# EAGLE design Breadboard (EAGLE 7.5.0)
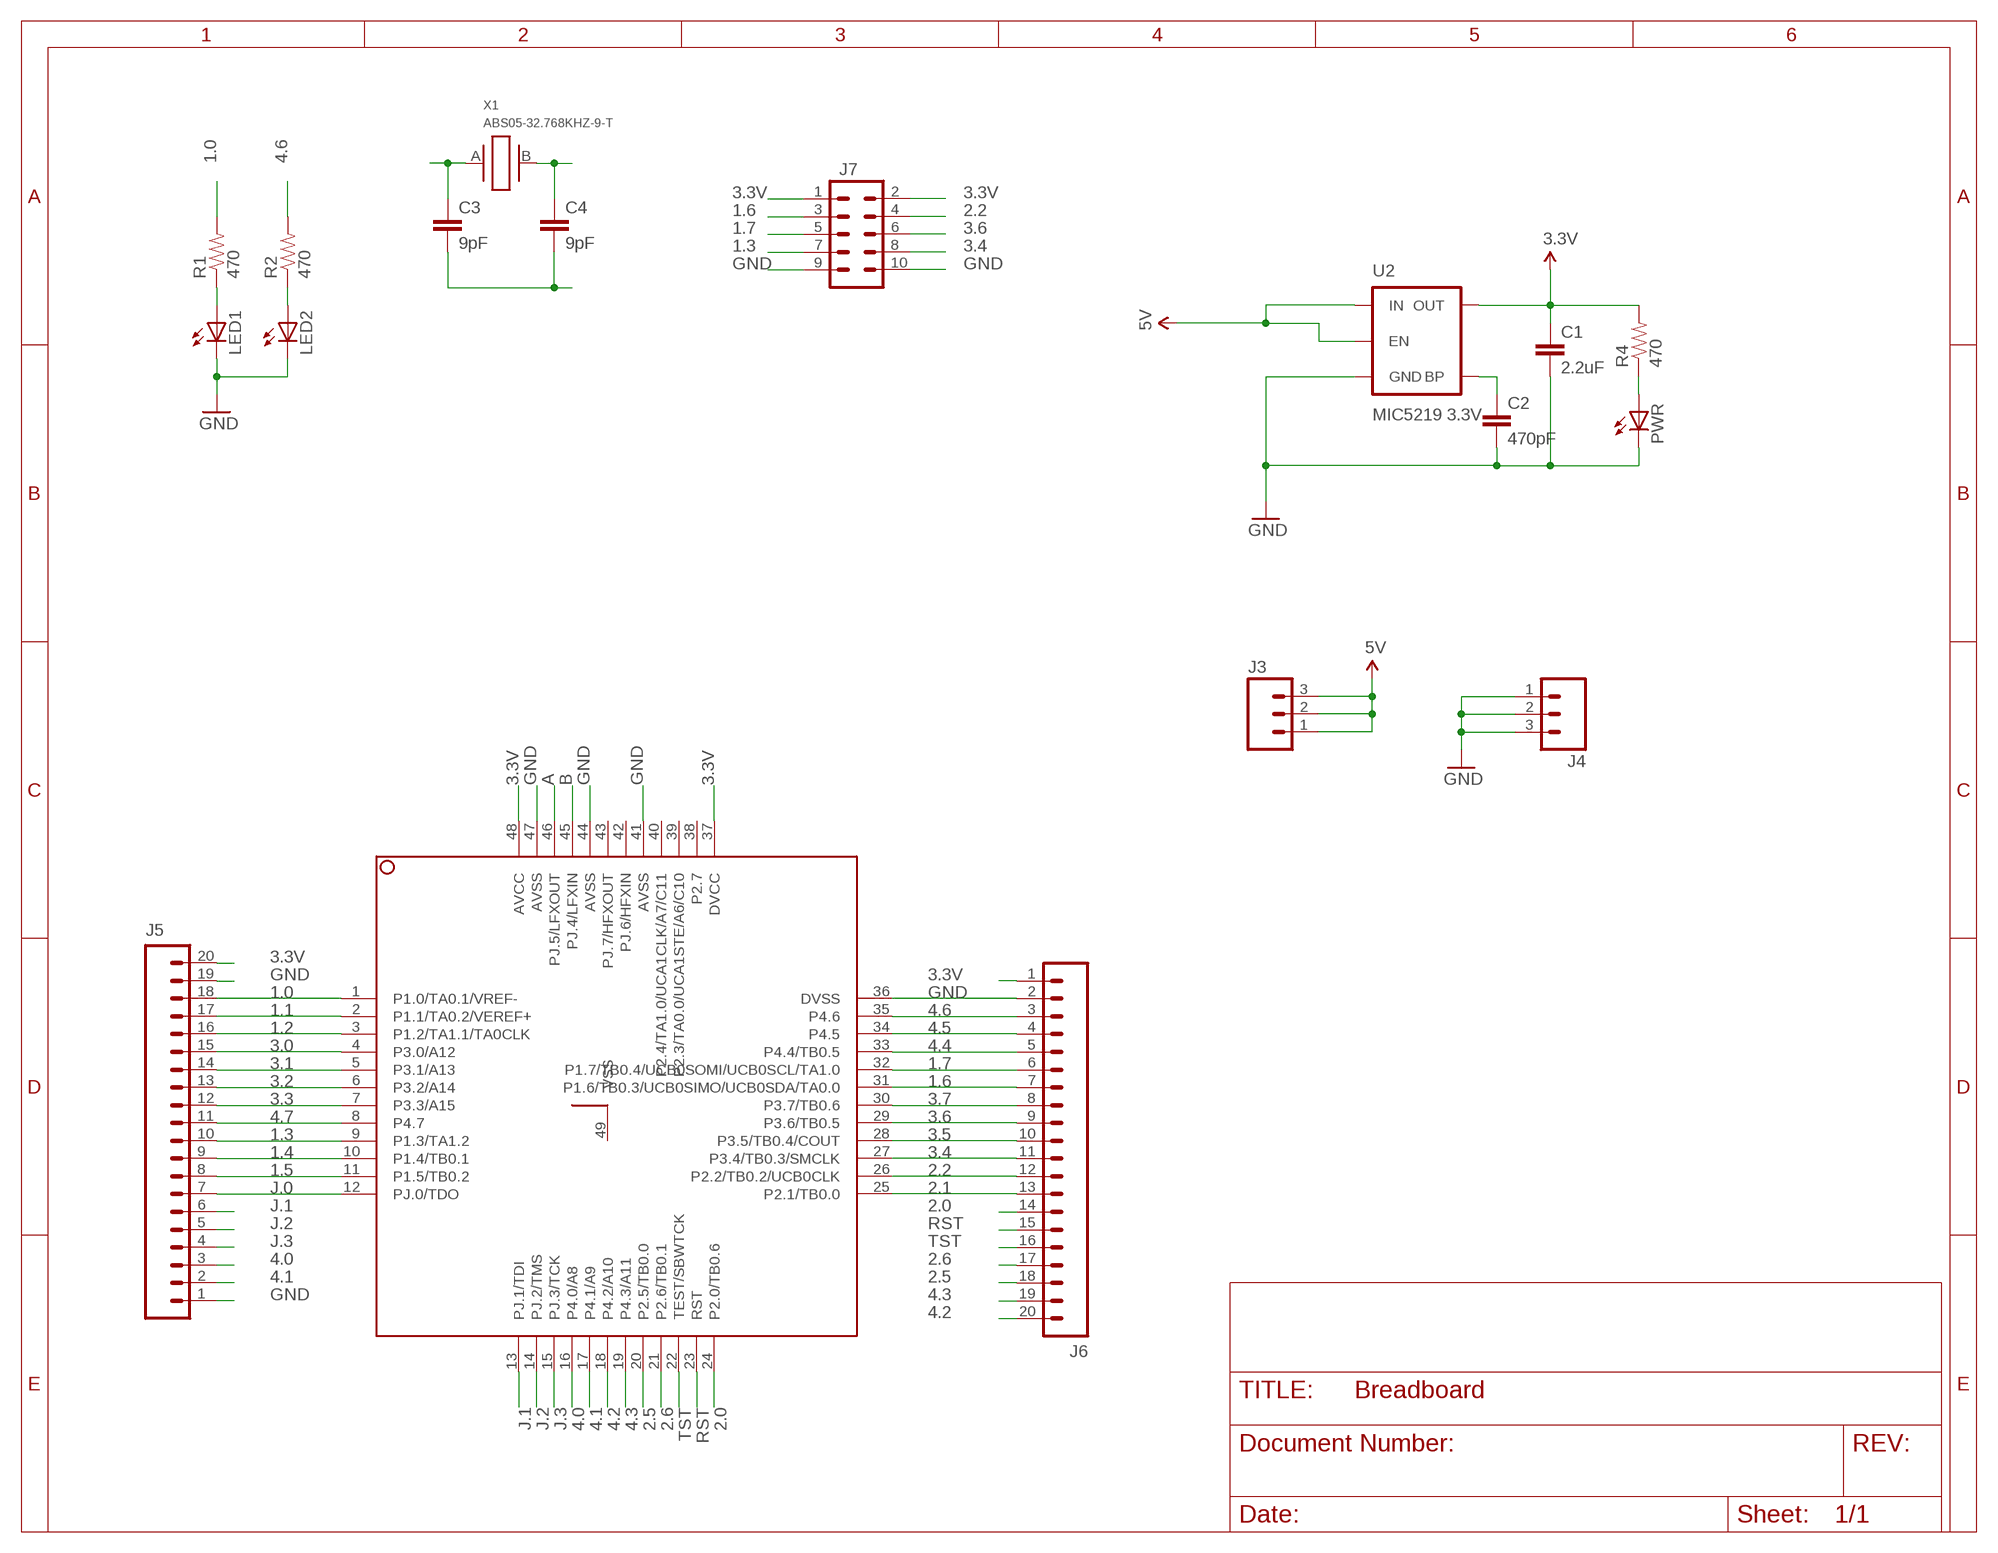
[diagram p0: schematic, sheet 1]

## Parts
C1  2.2uF  2.2UF-10V-20%(0603)  [0603-CAP]
C2  470pF  470PF-50V-5%(0603)SMD  [0603-CAP]
C3  9pF  9.0PF-50V-10%(0603)  [0603-CAP]
C4  9pF  9.0PF-50V-10%(0603)  [0603-CAP]
J3  M031X03_NO_SILK  [1X03_NO_SILK]
J4  M031X03_NO_SILK  [1X03_NO_SILK]
J5  M20NOSILK  [1X20_NOSILK]
J6  M20NOSILK  [1X20_NOSILK]
J7  M05X2NO_SILK  [2X5_NOSILK]
LED1  LEDCHIPLED_0805  [CHIPLED_0805]
LED2  LEDCHIPLED_0805  [CHIPLED_0805]
PWR  LEDCHIPLED_0805  [CHIPLED_0805]
R1  470  RESISTOR0805-RES  [0805]
R2  470  RESISTOR0805-RES  [0805]
R4  470  RESISTOR0805-RES  [0805]
U1  MSP430FR5969_RGZ_48  [RGZ48_4P1X4P1]
U2  MIC5219 3.3V  V_REG_MIC52193.3V  [SOT23-5]
X1  ABS05-32.768KHZ-9-T  [ABS05]

## Nets
1.0: J5.18 R1.2 U1.1(P1.0/TA0.1/VREF-)
1.1: J5.17 U1.2(P1.1/TA0.2/VEREF+)
1.2: J5.16 U1.3(P1.2/TA1.1/TA0CLK)
1.3: J5.10 J7.7 U1.9(P1.3/TA1.2)
1.4: J5.9 U1.10(P1.4/TB0.1)
1.5: J5.8 U1.11(P1.5/TB0.2)
1.6: J6.7 J7.3 U1.31(P1.6/TB0.3/UCB0SIMO/UCB0SDA/TA0.0)
1.7: J6.6 J7.5 U1.32(P1.7/TB0.4/UCB0SOMI/UCB0SCL/TA1.0)
2.0: J6.14 U1.24(P2.0/TB0.6)
2.1: J6.13 U1.25(P2.1/TB0.0)
2.2: J6.12 J7.4 U1.26(P2.2/TB0.2/UCB0CLK)
2.5: J6.18 U1.20(P2.5/TB0.0)
2.6: J6.17 U1.21(P2.6/TB0.1)
3.0: J5.15 U1.4(P3.0/A12)
3.1: J5.14 U1.5(P3.1/A13)
3.2: J5.13 U1.6(P3.2/A14)
3.3: J5.12 U1.7(P3.3/A15)
3.3V: C1.1 J5.20 J6.1 J7.1 J7.2 R4.2 U1.37(DVCC) U1.48(AVCC) U2.5(OUT)
3.4: J6.11 J7.8 U1.27(P3.4/TB0.3/SMCLK)
3.5: J6.10 U1.28(P3.5/TB0.4/COUT)
3.6: J6.9 J7.6 U1.29(P3.6/TB0.5)
3.7: J6.8 U1.30(P3.7/TB0.6)
4.0: J5.3 U1.16(P4.0/A8)
4.1: J5.2 U1.17(P4.1/A9)
4.2: J6.20 U1.18(P4.2/A10)
4.3: J6.19 U1.19(P4.3/A11)
4.4: J6.5 U1.33(P4.4/TB0.5)
4.5: J6.4 U1.34(P4.5)
4.6: J6.3 R2.2 U1.35(P4.6)
4.7: J5.11 U1.8(P4.7)
5V: J3.1 J3.2 J3.3 U2.1(IN) U2.3(EN)
A: C3.1 U1.46(PJ.5/LFXOUT) X1.A
B: C4.1 U1.45(PJ.4/LFXIN) X1.B
GND: C1.2 C2.2 C3.2 C4.2 J4.1 J4.2 J4.3 J5.1 J5.19 J6.2 J7.9 J7.10 LED1.C LED2.C PWR.C U1.36(DVSS) U1.41(AVSS) U1.44(AVSS) U1.47(AVSS) U2.2(GND)
J.0: J5.7 U1.12(PJ.0/TDO)
J.1: J5.6 U1.13(PJ.1/TDI)
J.2: J5.5 U1.14(PJ.2/TMS)
J.3: J5.4 U1.15(PJ.3/TCK)
N$1: LED2.A R2.1
N$2: PWR.A R4.1
N$4: LED1.A R1.1
N$7: C2.1 U2.4(BP)
RST: J6.15 U1.23(RST)
TST: J6.16 U1.22(TEST/SBWTCK)
Unconnected: U1.38(P2.7) U1.39(P2.3/TA0.0/UCA1STE/A6/C10) U1.40(P2.4/TA1.0/UCA1CLK/A7/C11) U1.42(PJ.6/HFXIN) U1.43(PJ.7/HFXOUT) U1.49(VSS)

## Library data of the parts
C1 = SparkFun-Capacitors:2.2UF-10V-20%(0603): CAP-07888; PROD_ID: CAP-07888
C2 = SparkFun-Capacitors:470PF-50V-5%(0603): CAP-07884; PROD_ID: CAP-07884
C3 C4 = SparkFun-Capacitors:9.0PF-50V-10%(0603): CAP-09341; PROD_ID: CAP-09341; VALUE: 9.0pF
J3 J4 = SparkFun-Connectors:M03: Header 3 Standard 3-pin 0.1" header. Use with straight break away headers (SKU : PRT-00116), right angle break away headers (PRT-00553), swiss pins (PRT-00743), machine pins (PRT-00117), and female headers (PRT-00115). Molex polarized connector foot print use with SKU : PRT-08232 with associated crimp pins and housings.
J5 J6 = SparkFun-Connectors:M20: 1x20 .1" header This is just like the LOCK variant in that the holes are staggared by 5 mil, but except for the last two holes. They are not altered from the "standard" footprint layout. This is used for a special purpose on the layout of our Graphic LCD Backpack. Make sure you want to use this device before selecting it for you project!
J7 = SparkFun-Connectors:M05X2: Header 5x2 Standard 10-pin dual row 0.1" header. Commonly used with AVR-ISP. Use with Spark Fun Electronics SKU: PRT-00778
LED1 LED2 PWR = adafruit:LED: LED OSRAM: - CHIPLED LG R971, LG N971, LY N971, LG Q971, LY Q971, LO R971, LY R971 LH N974, LH R974 LS Q976, LO Q976, LY Q976 LO Q996 - Hyper CHIPLED LW Q18S LB Q993, LB Q99A, LB R99A - SideLED LS A670, LO A670, LY A670, LG A670, LP A670 LB A673, LV A673, LT A673, LW A673 LH A674 LY A675 LS A676, LA A676, LO A676, LY A676, LW A676 LS A679, LY A679, LG A679 - Hyper Micro SIDELED® LS Y876, LA Y876, LO Y876, LY Y876 LT Y87S - SmartLED LW L88C, LW L88S LB L89C, LB L89S, LG L890 LS L89K, LO L89K, LY L89K LS L896, LA L896, LO L896, LY L896 - TOPLED LS T670, LO T670, LY T670, LG T670, LP T670 LSG T670, LSP T670, LSY T670, LOP T670, LYG T670 LG T671, LOG T671, LSG T671 LB T673, LV T673, LT T673, LW T673 LH T674 LS T676, LA T676, LO T676, LY T676, LB T676, LH T676, LSB T676, LW T676 LB T67C, LV T67C, LT T67C, LS T67K, LO T67K, LY T67K, LW E67C LS E67B, LA E67B, LO E67B, LY E67B, LB E67C, LV E67C, LT E67C LW T67C LS T679, LY T679, LG T679 LS T770, LO T770, LY T770, LG T770, LP T770 LB T773, LV T773, LT T773, LW T773 LH T774 LS E675, LA E675, LY E675, LS T675 LS T776, LA T776, LO T776, LY T776, LB T776 LHGB T686 LT T68C, LB T68C - Hyper Mini TOPLED® LB M676 - Mini TOPLED Santana® LG M470 LS M47K, LO M47K, LY M47K Source: http://www.osram.convergy.de/
R1 R2 R4 = SparkFun-Passives:RESISTOR: Resistor Basic schematic elements and footprints for 0603, 1206, and PTH resistors.
U1 = msp430:MSP430FR5969_RGZ_48: MSP430FR59xx Mixed Signal Microcontroller Package: RGZ-S-PQVFN-N48 (MSP430FR596x and MSP430FR586x) Description The Texas Instruments MSP430FR58xx and MSP430FR59xx family of ultralow-power microcontrollers consists of several devices featuring embedded FRAM nonvolatile memory, an ultralow-power 16-bit MSP430 CPU, and different sets of peripherals targeted for various applications. The architecture, FRAM, and peripherals, combined with seven low-power modes, are optimized to achieve extended battery life in portable and wireless sensing applications. FRAM is a new nonvolatile memory that combines the speed, flexibility, and endurance of SRAM with the stability and reliability of flash, all at lower total power consumption.; MANUFACTURER_PART_NUMBER: msp430fr5969_rgz_48; VENDOR: Texas Instruments
U2 = SparkFun-PowerIC:V_REG_MIC5219: V_REG MIC5219 Standard 3.3V and 5V 500mA LDO voltage regulator in SOT-23 layout. Micrel part MIC5219. BP (by-pass) pin is used to lower output noise with 470pF cap, may be left open.; PROD_ID: VREG-09872
X1 = abs05:ABS05-32.768KHZ: 32.768kHz Crystal; DIGIKEY: 535-11897-1-ND

## Board
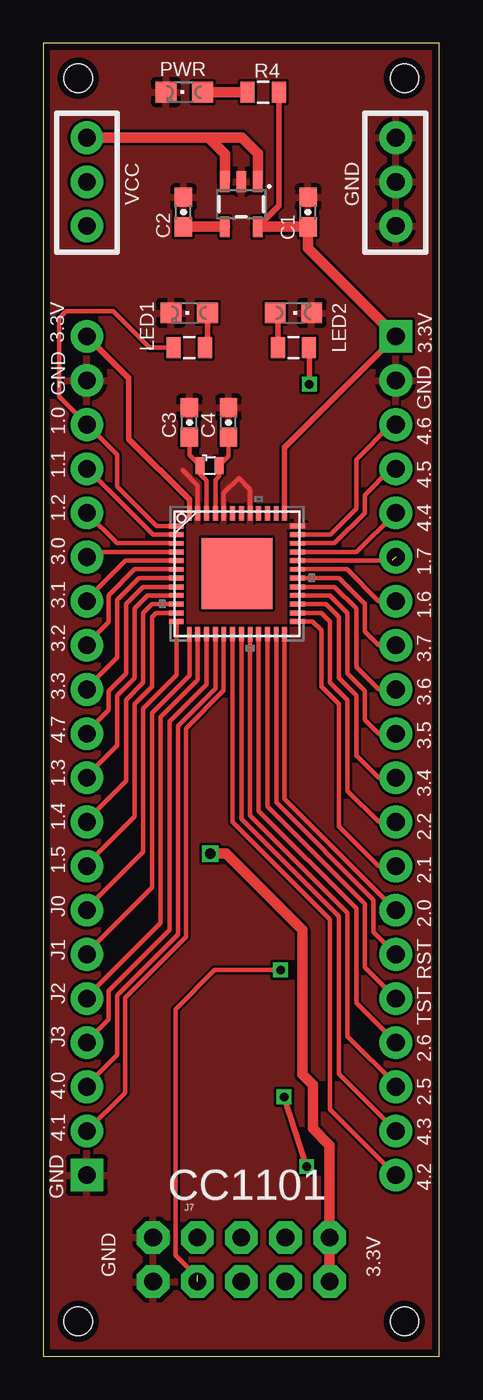
[diagram p1: board, top side]
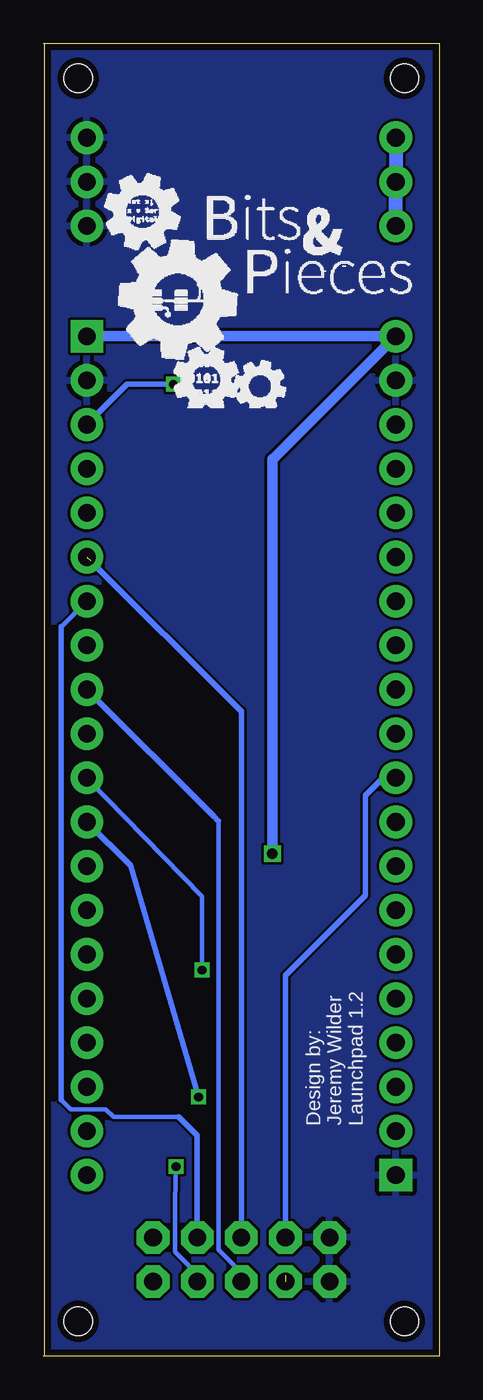
[diagram p2: board, bottom side, seen from below]

Size 22.78 x 75.5 mm. Coordinates in mm from the lower left corner, seen from the top.
Outline: 22.75,0 0,0 0,75.5 22.75,75.5
Outline: 22.75,0 22.78,0
Outline: 22.78,75.5 22.75,75.5
Outline: 22.75,75.5 22.75,0
Copper layers (1*16): Top 0.0356mm / dielectric 1.5011mm / Bottom 0.0356mm
Design rules "oshpark-2layer": minimum track width 6mil, minimum drill 13mil, track to track 6mil, track to pad 6mil, pad to pad 6mil, via to via 6mil, smd to smd 6mil, copper to edge 15mil, drill to drill 6mil, minimum pad ring 7mil, minimum via ring 7mil, stop-mask expansion 2.5mil, vias tented up to drill 0mil, thermal gap 10mil
Holes 1.6 mm at 2,73.5 20.78,73.5 2,2 20.78,2

### Footprints (pad centres in the part's own frame; a part is rotated, then mirrored left to right if it is on the bottom)
0603-CAP = smd 1.1 x 1: 1 -0.85,0; 2 0.85,0
1X03_NO_SILK = drill 1.016 pad 1.88: 1 0,0; 2 2.54,0; 3 5.08,0
1X20_NOSILK = drill 1.016 pad 1.88 square: 1 0,0 | drill 1.016 pad 1.88: 2 2.54,0; 3 5.08,0; 4 7.62,0; 5 10.16,0; 6 12.7,0; 7 15.24,0; 8 17.78,0; 9 20.32,0; 10 22.86,0; 11 25.4,0; 12 27.94,0; 13 30.48,0; 14 33.02,0; 15 35.56,0; 16 38.1,0; 17 40.64,0; 18 43.18,0; 19 45.72,0; 20 48.26,0
2X5_NOSILK = drill 1.016 pad 1.88 octagon: 1 -1.27,5.08; 2 1.27,5.08; 3 -1.27,2.54; 4 1.27,2.54; 5 -1.27,0; 6 1.27,0; 7 -1.27,-2.54; 8 1.27,-2.54; 9 -1.27,-5.08; 10 1.27,-5.08
CHIPLED_0805 = smd 1.2 x 1.2: A 0,-1.05; C 0,1.05
0805 = smd 0.8 x 1.2: 1 -0.9,0; 2 0.9,0
RGZ48_4P1X4P1 = smd 0.838 x 0.279: 1 -3.48,2.743; 2 -3.48,2.261; 3 -3.48,1.753; 4 -3.48,1.245; 5 -3.48,0.762; 6 -3.48,0.254; 7 -3.48,-0.254; 8 -3.48,-0.762; 9 -3.48,-1.245; 10 -3.48,-1.753; 11 -3.48,-2.261; 12 -3.48,-2.743; 25 3.48,-2.743; 26 3.48,-2.261; 27 3.48,-1.753; 28 3.48,-1.245; 29 3.48,-0.762; 30 3.48,-0.254; 31 3.48,0.254; 32 3.48,0.762; 33 3.48,1.245; 34 3.48,1.753; 35 3.48,2.261; 36 3.48,2.743 | smd 0.279 x 0.838: 13 -2.743,-3.48; 14 -2.261,-3.48; 15 -1.753,-3.48; 16 -1.245,-3.48; 17 -0.762,-3.48; 18 -0.254,-3.48; 19 0.254,-3.48; 20 0.762,-3.48; 21 1.245,-3.48; 22 1.753,-3.48; 23 2.261,-3.48; 24 2.743,-3.48; 37 2.743,3.48; 38 2.261,3.48; 39 1.753,3.48; 40 1.245,3.48; 41 0.762,3.48; 42 0.254,3.48; 43 -0.254,3.48; 44 -0.762,3.48; 45 -1.245,3.48; 46 -1.753,3.48; 47 -2.261,3.48; 48 -2.743,3.48 | smd 4.089 x 4.089: 49 0,0
SOT23-5 = smd 0.55 x 1.2: 1 -0.95,-1.3; 2 0,-1.3; 3 0.95,-1.3; 4 0.95,1.3; 5 -0.95,1.3
ABS05 = smd 0.5 x 1: A -0.55,0; B 0.55,0

### Placement (x,y rotation side)
C1  15.23,65.8 90 top
C2  8.05,65.8 90 top
C3  8.4,53.7 90 top
C4  10.65,53.7 90 top
J3  2.5,65 90 top
J4  20.28,70.08 270 top
J5  2.5,10.4 90 top
J6  20.28,58.66 270 top
J7  11.39,5.55 270 top
LED1  8.39,60 90 top
LED2  14.39,60 270 top
PWR  8.1,72.7 90 top
R1  8.39,58 180 top
R2  14.39,58 0 top
R4  12.65,72.7 0 top
U1  11.14,45 0 top
U2  11.39,66.25 180 top
X1  9.56,51.22 0 top

### Tracks (layer width: path | path; a pad name or v marks a point on that pad's centre or on a via)
1.0
  Top 0.254: U1.1 6.51,47.74 4.25,50 4.25,51.85 2.52,53.58 J5.18 2.5,53.6 0.9,55.2 0.9,59.7 1.3,60.1 4,60.1 6.1,58 R1.2
1.1
  Top 0.254: U1.2 6.3,47.26 2.52,51.04 J5.17
1.2
  Top 0.254: U1.3 4.25,46.75 J5.16
1.3
  Top 0.254: U1.9 6,43.76 5.25,43 5.25,39 4.25,38 4.25,35.11 2.5,33.36 J5.10
  Bottom 0.305: J7.7 8.85,21.9 4.25,26.5 4.25,32.25 3.22,33.28 2.52,33.28 J5.10
1.4
  Top 0.254: U1.10 6.25,43.25 5.75,42.75 5.75,38.75 4.75,37.75 4.75,33.07 2.5,30.82 J5.9
1.5
  Top 0.254: U1.11 6.49,42.74 6.25,42.5 6.25,38.5 5.25,37.5 5.25,31.03 2.5,28.28 J5.8
1.6
  Top 0.254: U1.31 17.46,45.25 19.27,43.44 20.26,43.44 J6.7
  Bottom 0.254: 15,13.75 18.75,13.75 19.2,14.2 21.2,14.2 21.75,14.75 | 21.75,41.97 21.73,41.97 J6.7
  Bottom 0.305: 21.75,14.75 21.75,41.97 | J7.3 13.93,12.68 15,13.75
1.7  (1 unrouted)
  Top 0.254: U1.32 20.06,45.76
  Bottom 0.305: J7.5 11.39,37.09 11.41,37.09 J6.6
2.0
  Top 0.254: U1.24 13.88,32.04 J6.14
2.1
  Top 0.254: U1.25 15.49,42.26 16,41.75 16,38.5 17,37.5 17,30.47 19.27,28.2 20.26,28.2 J6.13
2.2  (via drill 0.5)
  Top 0.254: U1.26 16.01,42.74 16.5,42.25 16.5,38.75 17.5,37.75 17.5,32.51 19.27,30.74 20.26,30.74 J6.12
  Top 0.305: v15.15,10.9 v13.85,14.9
  Bottom 0.254: J7.4 13.93,4.73 15.2,6 15.2,8.95 v15.15,10.9
  Bottom 0.305: v13.85,14.9 17.75,28.21 17.77,28.21 J6.12
2.5
  Top 0.254: U1.20 11.9,31.1 17.5,25.5 17.5,18.4 20.28,15.62 J6.18
2.6
  Top 0.254: U1.21 12.38,31.36 18,25.75 18,20.32 20.28,18.04 J6.17
3.0
  Top 0.254: U1.4 2.77,46.24 2.77,46.23 J5.15
3.1
  Top 0.254: U1.5 4.74,45.76 2.5,43.52 J5.14
3.2
  Top 0.254: U1.6 5.25,45.25 3.75,43.75 3.75,42.23 2.5,40.98 J5.13
3.3
  Top 0.254: U1.7 5.5,44.75 4.25,43.5 4.25,40.19 2.5,38.44 J5.12
3.3V  (via drill 0.6)
  Top 0.305: U1.37 13.88,52.28 13.9,52.28 J6.1 | U1.48 8.4,49.25 4.9,52.75 4.9,56.28 4.88,56.28 J5.20 | R4.2 13.55,66.16 U2.5
  Top 0.61: U2.5 C1.1 | C1.1 | C1.1 15.23,63.73 20.28,58.68 J6.1 | J7.2 J7.1 16.47,12.13 15.5,13.1 15.5,15.6 14.9,16.2 14.9,24.5 10.5,28.9 v9.6,28.9
  Bottom 0.61: v9.6,28.9 9.6,51.58 9.58,51.58 J5.20 J6.1
3.4  (via drill 0.5)  (1 unrouted)
  Top 0.254: U1.27 16.25,43.25 17,42.5 17,39 18,38 18,34.55 19.27,33.28 20.26,33.28 J6.11 | 8.85,4.65 8.75,4.65 7.6,5.8 7.6,19.95 9.85,22.2 v13.65,22.2
  Bottom 0.254: v13.65,22.2 13.65,26.43 J6.11
3.5
  Top 0.254: U1.28 16.5,43.76 17.5,42.75 17.5,39.25 18.5,38.25 18.5,36.59 19.27,35.82 20.26,35.82 J6.10
3.6
  Top 0.254: U1.29 16.76,44.24 18,43 18,39.63 19.27,38.36 20.26,38.36 J6.9
  Bottom 0.254: J7.6 11.39,4.99 11.59,4.99 12.7,6.1 12.7,30.76 12.97,31.03
  Bottom 0.305: 12.7,30.78 12.72,30.78 12.97,31.03 J6.9
3.7
  Top 0.254: U1.30 17,44.75 18.5,43.25 18.5,41.67 19.27,40.9 20.26,40.9 J6.8
4.0
  Top 0.254: U1.16 9.89,38.4 7.75,36.25 7.75,24.25 4.25,20.75 4.25,17.33 2.5,15.58 J5.3
4.1
  Top 0.254: U1.17 10.38,38.28 8.2,36.1 8.2,24.1 4.7,20.6 4.7,15.14 J5.2
4.2
  Top 0.254: U1.18 10.89,30.71 16.5,25.1 16.5,14.18 J6.20
4.3
  Top 0.254: U1.19 11.39,30.91 17,25.3 17,16.22 J6.19
4.4
  Top 0.254: U1.33 18.02,46.24 J6.5
4.5
  Top 0.254: U1.34 16.75,46.75 18.5,48.5 18.5,49.53 20.01,51.04 J6.4
4.6  (via drill 0.5)
  Top 0.254: U1.35 16.51,47.26 18,48.75 18,51.57 20.01,53.58 J6.3
  Top 0.305: v15.3,55.9 R2.2
  Bottom 0.305: v15.3,55.9 17.96,55.9 J6.3
4.7
  Top 0.254: U1.8 5.74,44.24 4.75,43.25 4.75,39.25 3.75,38.25 3.75,37.15 2.5,35.9 J5.11
5V
  Top 0.61: U2.1 12.34,69.16 11.42,70.08 9.5,70.08 | 9.5,70.08 J3.3 | U2.3 10.44,69.14 9.5,70.08
  Bottom 0.813: J3.1 J3.2 J3.3
A
  Top 0.254: U1.46 9.39,50.36 9.01,50.74 X1.A 8.4,51.83 C3.1
B
  Top 0.254: U1.45 9.89,50.4 10.11,50.61 X1.B 10.65,51.76 C4.1
GND
  Top 0.254: U1.41 11.9,49.85 11.25,50.5 10.38,49.63 U1.44 | U1.47 8.88,50.07 8,50.95
  pour Bottom: 0,75.5 22.78,75.5 22.78,0 0,0
  pour Top: 0.02,75.5 22.78,75.5 22.78,0 0.27,0
J.0
  Top 0.254: U1.12 7.66,39.16 5.75,37.25 5.75,28.99 2.5,25.74 J5.7
J.1
  Top 0.254: U1.13 8.4,39.15 6.25,37 6.25,26.95 2.5,23.2 J5.6
J.2
  Top 0.254: U1.14 8.88,38.88 6.75,36.75 6.75,24.91 2.5,20.66 J5.5
J.3
  Top 0.254: U1.15 9.39,38.64 7.25,36.5 7.25,24.5 3.75,21 3.75,19.37 2.5,18.12 J5.4
N$1
  Top 0.305: R2.1 13.49,59.85 LED2.A
N$2
  Top 0.61: R4.1 PWR.A
N$4
  Top 0.305: LED1.A 9.44,58.15 R1.1
N$7
  Top 0.61: 7.95,64.95 C2.1 U2.4
RST
  Top 0.254: U1.23 13.4,31.85 19,26.25 19,24.4 20.28,23.12 J6.15
TST
  Top 0.254: U1.22 12.89,31.61 18.5,26 18.5,22.36 20.28,20.58 J6.16

### Text on the board
tPlace: GND | BREAKOUT / POWER | VCC | 3.3V | 3.3V | GND | GND | 4.6 | 1.0 | 4.5 | 1.1 | 4.4 | 1.2 | 3.0 | 1.7 | 1.6 | 3.1 | 3.7 | 3.2 | 3.6 | 3.3 | 3.5 | 4.7 | 3.4 | 1.3 | 2.2 | 1.4 | 2.1 | 1.5 | 2.0 | J0 | RST | J1 | TST | J2 | J3 | 2.6 | 2.5 | 4.0 | 4.3 | 4.1 | CC1101 | 4.2 | GND | GND | 3.3V
bPlace: Design by: / Jeremy Wilder / Launchpad 1.2